# EAGLE design Schem (EAGLE 5.10)
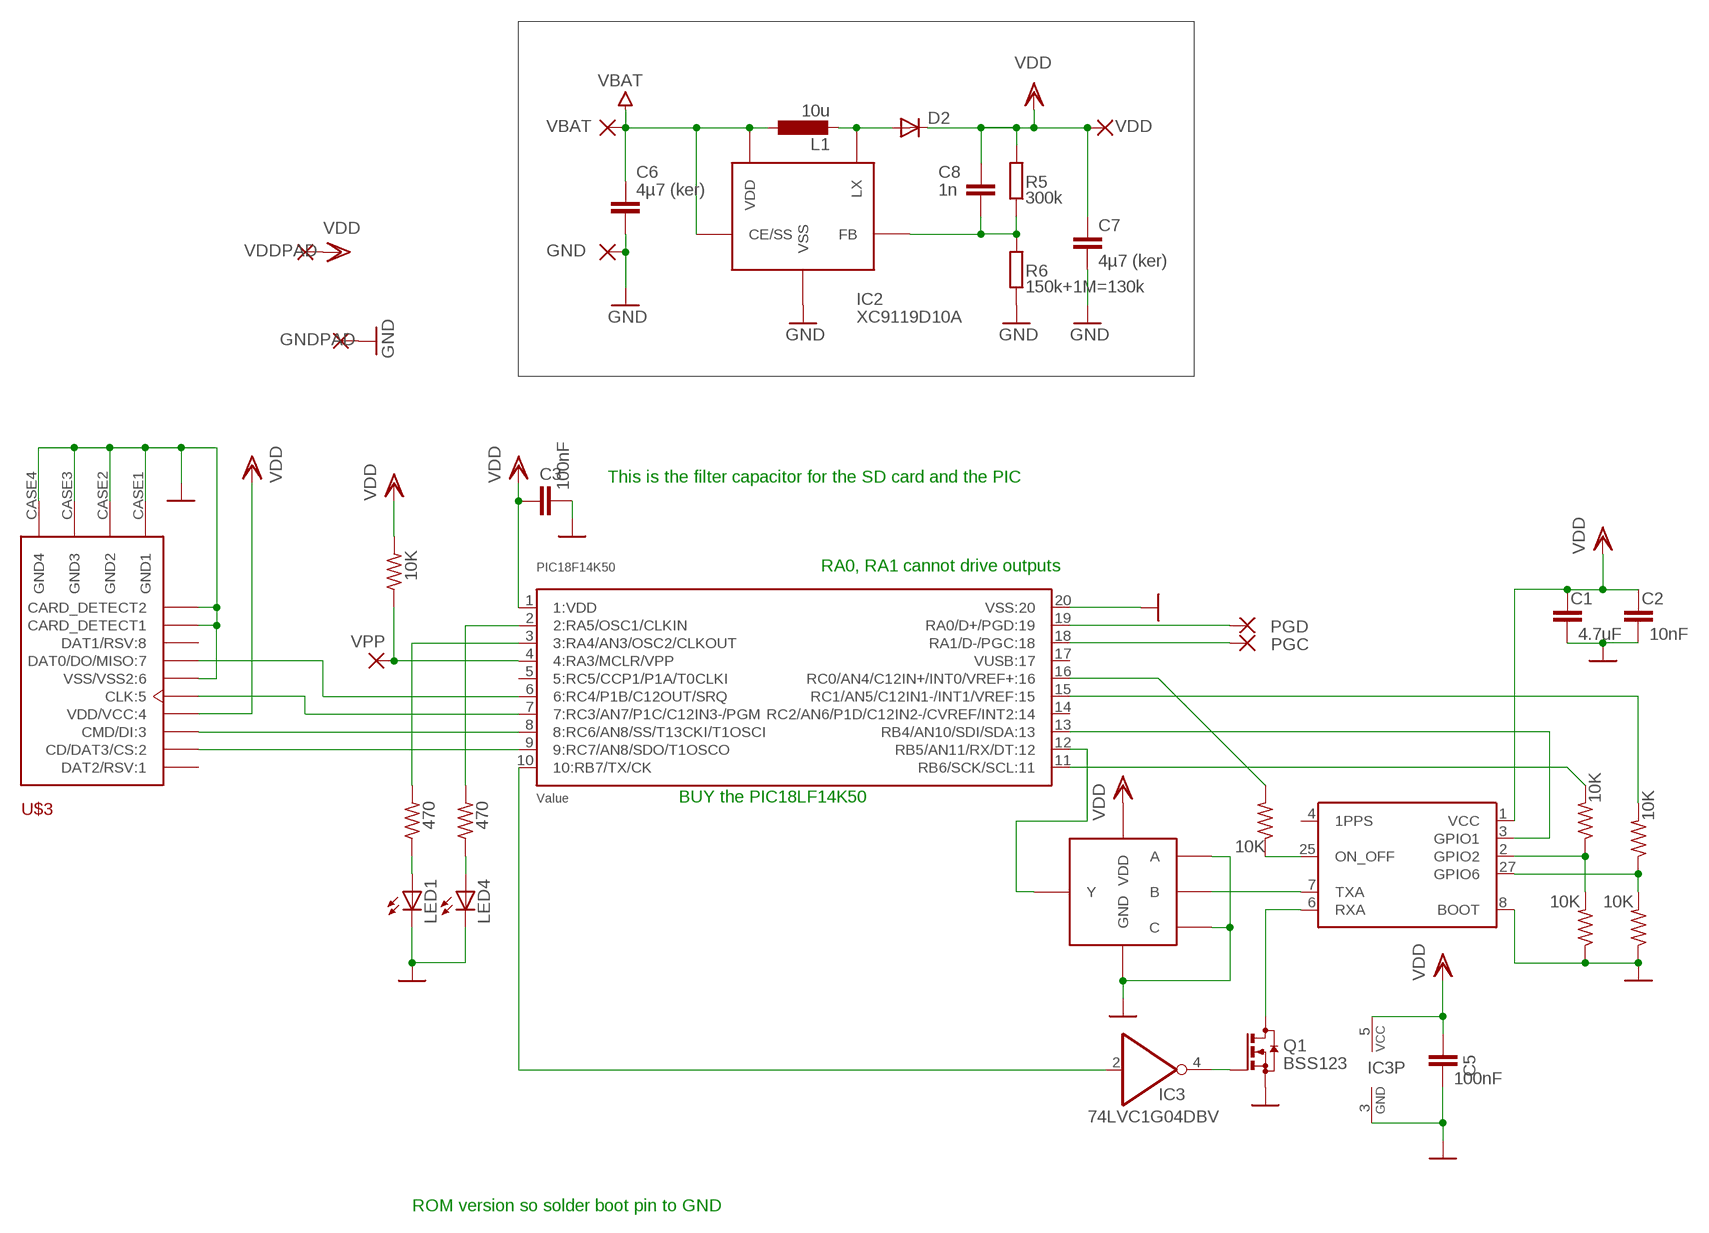
[diagram p0: schematic, sheet 1]

## Parts
C1  4.7uF  C-EUC0805  [C0805]
C2  10nF  C-EUC0805  [C0805]
C3  100nF  C-EUC0805  [C0805]
C5  100nF  C-EUC0805  [C0805]
C6  4µ7 (ker)  C-EUC0805  [C0805]
C7  4µ7 (ker)  C-EUC0805  [C0805]
C8  1n  C-EUC0805  [C0805]
D2  DIODE-MINIMELF  [MINIMELF]
GND  SMD2  [SMD1,27-2,54]
GNDPAD  SMD2  [SMD1,27-2,54]
IC2  XC9119D10A  [SOT23-5]
IC3  74LVC1G04DBV  [SOT23-5]
L1  10u  WE-TCP_DROSSELDEF  [WE-TPC]
LED1  LEDCHIPLED_0805  [CHIPLED_0805]
LED4  LEDCHIPLED_0805  [CHIPLED_0805]
PGC  SMD2  [SMD1,27-2,54]
PGD  SMD2  [SMD1,27-2,54]
Q1  BSS123  [SOT23]
R1  10K  R-US_M0805  [M0805]
R2  10K  R-US_M0805  [M0805]
R3  10K  R-US_M0805  [M0805]
R4  10K  R-US_M0805  [M0805]
R5  300k  R-EU_R0805  [R0805]
R6  150k+1M=130k  R-EU_R0805  [R0805]
R7  10K  R-US_M0805  [M0805]
R9  470  R-US_M0805  [M0805]
R10  10K  R-US_M0805  [M0805]
R11  470  R-US_M0805  [M0805]
U$1  FASTRAXUC322  [FASTRAXUC322]
U$2  PIC18LF14K50_DIP20  PIC18F14K50_DIP20  [SSOP20]
U$3  MIKRO_SD_CARD  [MIKRO_SD_CARD_HOLDER]
U$4  SN74AUP1T97  [SOT23-6]
VBAT  SMD2  [SMD1,27-2,54]
VDD  SMD2  [SMD1,27-2,54]
VDDPAD  SMD2  [SMD1,27-2,54]
VPP  SMD2  [SMD1,27-2,54]

## Nets
GND: C1.2 C2.2 C3.2 C5.2 C6.2 C7.2 GND.1(P) GNDPAD.1(P) IC2.P$2(VSS) IC3.3(GND) LED1.C LED4.C Q1.2(S) R2.1 R6.1 R7.1 U$1.8(BOOT) U$2.20(VSS:20) U$3.C_DETECT1(CARD_DETECT1) U$3.C_DETECT2(CARD_DETECT2) U$3.CASE1(GND1) U$3.CASE2(GND2) U$3.CASE3(GND3) U$3.CASE4(GND4) U$3.P6(VSS/VSS2:6) U$4.P$2(GND) U$4.P$3(A) U$4.P$6(C)
N$1: R1.1 U$2.4(4:RA3/MCLR/VPP) VPP.1(P)
N$2: IC3.2(I) U$2.10(10:RB7/TX/CK)
N$3: PGC.1(P) U$2.18(RA1/D-/PGC:18)
N$4: R4.1 R7.2 U$1.2(GPIO2)
N$5: U$2.12(RB5/AN11/RX/DT:12) U$4.P$4(Y)
N$6: R2.2 R3.1 U$1.27(GPIO6)
N$7: R10.2 U$2.16(RC0/AN4/C12IN+/INT0/VREF+:16)
N$9: D2.A IC2.P$1(LX) L1.P$2
N$10: C8.2 IC2.P$3(FB) R5.1 R6.2
N$11: IC3.4(O) Q1.1(G)
N$12: R4.2 U$2.11(RB6/SCK/SCL:11)
N$13: U$1.3(GPIO1) U$2.13(RB4/AN10/SDI/SDA:13)
N$14: Q1.3(D) U$1.6(RXA)
N$15: PGD.1(P) U$2.19(RA0/D+/PGD:19)
N$16: LED1.A R9.1
N$17: U$1.7(TXA) U$4.P$1(B)
N$18: R9.2 U$2.3(3:RA4/AN3/OSC2/CLKOUT)
N$19: R3.2 U$2.15(RC1/AN5/C12IN1-/INT1/VREF:15)
N$20: U$2.9(9:RC7/AN8/SDO/T1OSCO) U$3.P2(CD/DAT3/CS:2)
N$21: U$2.8(8:RC6/AN8/SS/T13CKI/T1OSCI) U$3.P3(CMD/DI:3)
N$22: U$2.7(7:RC3/AN7/P1C/C12IN3-/PGM) U$3.P5(CLK:5)
N$23: U$2.6(6:RC4/P1B/C12OUT/SRQ) U$3.P7(DAT0/DO/MISO:7)
N$25: R11.2 U$2.2(2:RA5/OSC1/CLKIN)
N$27: R10.1 U$1.25(ON_OFF)
N$30: LED4.A R11.1
VBAT: C6.1 IC2.P$4(CE/SS) IC2.P$5(VDD) L1.P$1 VBAT.1(P)
VDD: C1.1 C2.1 C3.1 C5.1 C7.1 C8.1 D2.C IC3.5(VCC) R1.2 R5.2 U$1.1(VCC) U$2.1(1:VDD) U$3.P4(VDD/VCC:4) U$4.P$5(VDD) VDD.1(P) VDDPAD.1(P)
Unconnected: U$1.4(1PPS) U$2.5(5:RC5/CCP1/P1A/T0CLKI) U$2.14(RC2/AN6/P1D/C12IN2-/CVREF/INT2:14) U$2.17(VUSB:17) U$3.P1(DAT2/RSV:1) U$3.P8(DAT1/RSV:8)

## Notes on the sheet
- This is the filter capacitor for the SD card and the PIC
- RA0, RA1 cannot drive outputs
- BUY the PIC18LF14K50
- ROM version so solder boot pin to GND

## Power pins joined to a net without a drawn wire
GND: U$1.5(GND) U$1.9(GND) U$1.10(GND) U$1.11(GND) U$1.12(GND) U$1.13(GND) U$1.14(GND) U$1.15(GND) U$1.16(GND) U$1.17(GND) U$1.18(GND) U$1.19(GND) U$1.20(GND) U$1.21(GND) U$1.22(GND) U$1.23(GND) U$1.24(GND) U$1.26(GND)

## Library data of the parts
C1-C3 C5-C8 = rcl:C-EU: CAPACITOR, European symbol
D2 = diode:DIODE-: DIODE
GND GNDPAD PGC PGD VBAT VDD VDDPAD VPP = wirepad:SMD2: SMD PAD
IC2 = 00 Meine Bauteile:XC9119D10A
IC3 = 74xx-little-de:74*1G04: INVERTER Gate
L1 = Parts_for_Marcus:WE-TCP_DROSSEL
LED1 LED4 = led:LED: LED OSRAM: - CHIPLED LG R971, LG N971, LY N971, LG Q971, LY Q971, LO R971, LY R971 LH N974, LH R974 LS Q976, LO Q976, LY Q976 LO Q996 - Hyper CHIPLED LW Q18S LB Q993, LB Q99A, LB R99A - SideLED LS A670, LO A670, LY A670, LG A670, LP A670 LB A673, LV A673, LT A673, LW A673 LH A674 LY A675 LS A676, LA A676, LO A676, LY A676, LW A676 LS A679, LY A679, LG A679 - Hyper Micro SIDELED® LS Y876, LA Y876, LO Y876, LY Y876 LT Y87S - SmartLED LW L88C, LW L88S LB L89C, LB L89S, LG L890 LS L89K, LO L89K, LY L89K LS L896, LA L896, LO L896, LY L896 - TOPLED LS T670, LO T670, LY T670, LG T670, LP T670 LSG T670, LSP T670, LSY T670, LOP T670, LYG T670 LG T671, LOG T671, LSG T671 LB T673, LV T673, LT T673, LW T673 LH T674 LS T676, LA T676, LO T676, LY T676, LB T676, LH T676, LSB T676, LW T676 LB T67C, LV T67C, LT T67C, LS T67K, LO T67K, LY T67K, LW E67C LS E67B, LA E67B, LO E67B, LY E67B, LB E67C, LV E67C, LT E67C LW T67C LS T679, LY T679, LG T679 LS T770, LO T770, LY T770, LG T770, LP T770 LB T773, LV T773, LT T773, LW T773 LH T774 LS E675, LA E675, LY E675, LS T675 LS T776, LA T776, LO T776, LY T776, LB T776 LHGB T686 LT T68C, LB T68C - Hyper Mini TOPLED® LB M676 - Mini TOPLED Santana® LG M470 LS M47K, LO M47K, LY M47K Source: http://www.osram.convergy.de LUXEON: - LUMILED® LXK2-PW12-R00, LXK2-PW12-S00, LXK2-PW14-U00, LXK2-PW14-V00 LXK2-PM12-R00, LXK2-PM12-S00, LXK2-PM14-U00 LXK2-PE12-Q00, LXK2-PE12-R00, LXK2-PE12-S00, LXK2-PE14-T00, LXK2-PE14-U00 LXK2-PB12-K00, LXK2-PB12-L00, LXK2-PB12-M00, LXK2-PB14-N00, LXK2-PB14-P00, LXK2-PB14-Q00 LXK2-PR12-L00, LXK2-PR12-M00, LXK2-PR14-Q00, LXK2-PR14-R00 LXK2-PD12-Q00, LXK2-PD12-R00, LXK2-PD12-S00 LXK2-PH12-R00, LXK2-PH12-S00 LXK2-PL12-P00, LXK2-PL12-Q00, LXK2-PL12-R00 Source: www.luxeon.com KINGBRIGHT: KA-3528ASYC Source: www.kingbright.com
Q1 = transistor-small-signal:BSS123: N-CHANNEL MOS FET
R1-R4 R7 R9-R11 = resistor:R-US_: RESISTOR, American symbol
R5 R6 = rcl:R-EU_: RESISTOR, European symbol
U$1 = MyLib:FASTRAXUC322: Fastrax UC322 OEM GPS Receiver module
U$2 = MyLib:PIC18F14K50_DIP20
U$3 = Parts_for_Marcus:MIKRO_SD_CARD
U$4 = buffer:SN74AUP1T97

## Board
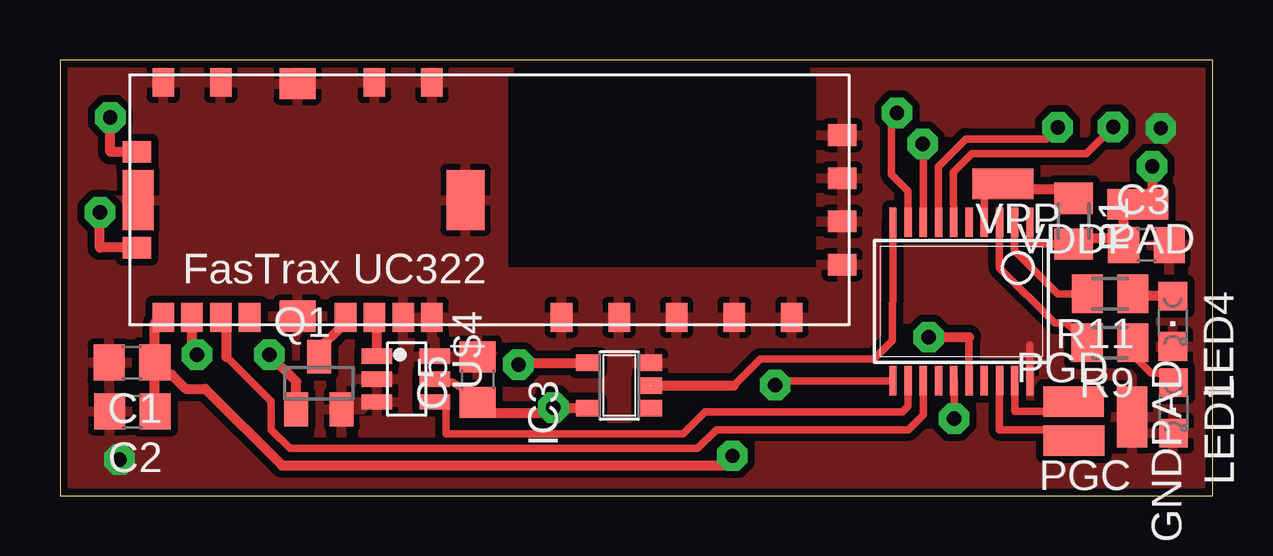
[diagram p1: board, top side]
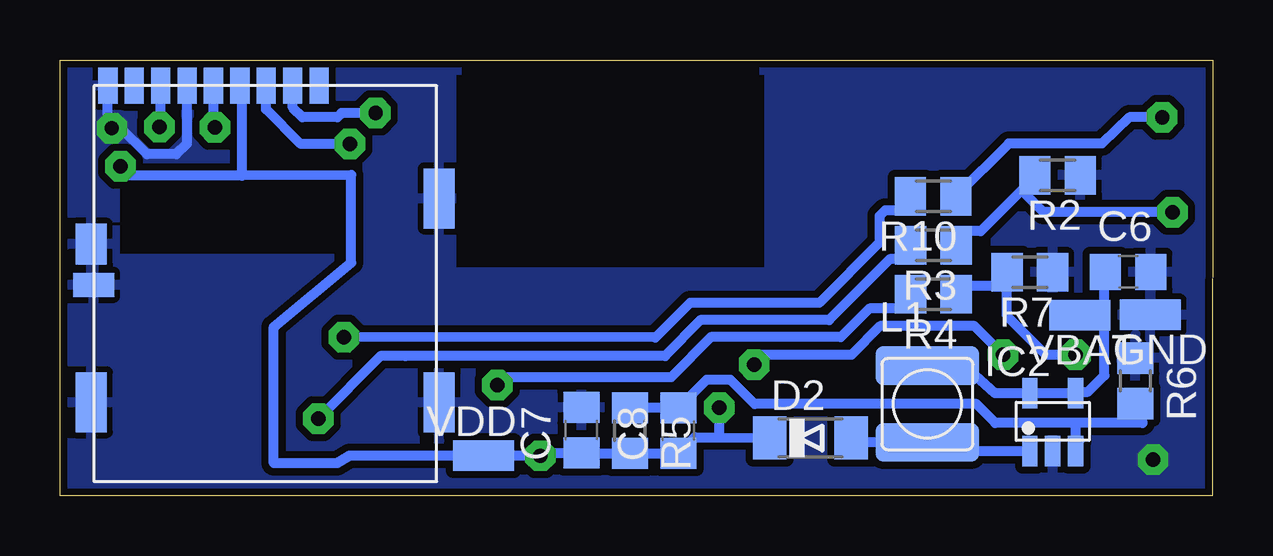
[diagram p2: board, bottom side, seen from below]

Size 48.04 x 18.18 mm. Coordinates in mm from the lower left corner, seen from the top.
Outline: 0,0 48.04,0 48.04,18.17 0,18.18 0,0
Copper layers (1*16): Top 0.035mm / dielectric 1.5mm / Bottom 0.035mm
Design rules "default *": minimum track width 10mil, minimum drill 0.6mm, track to track 12mil, track to pad 12mil, pad to pad 12mil, via to via 12mil, smd to smd 12mil, copper to edge 12mil, drill to drill 8mil, minimum pad ring 10mil, minimum via ring 8mil, stop-mask expansion 4mil, vias tented up to drill 0mil, thermal gap 10mil

### Footprints (pad centres in the part's own frame; a part is rotated, then mirrored left to right if it is on the bottom)
C0805 = smd 1.3 x 1.5: 1 -0.95,0; 2 0.95,0
MINIMELF = smd 1.4 x 1.8: A 1.7,0; C -1.7,0
SMD1,27-2,54 = smd 1.27 x 2.54: 1 0,0
SOT23-5 = smd 0.635 x 1.27: P$1 -0.953,-1.206; P$2 0,-1.206; P$3 0.953,-1.206; P$4 0.953,1.206; P$5 -0.953,1.206
SOT23-5' = smd 0.69 x 0.99: 1 -0.95,-1.29; 2 0,-1.29; 3 0.95,-1.29; 4 0.95,1.3; 5 -0.95,1.3
WE-TPC = smd 4.3 x 1.6: P$1 0,1.6; P$2 0,-1.6
CHIPLED_0805 = smd 1.2 x 1.2: A 0,-1.05; C 0,1.05
SOT23 = smd 1 x 1.4: 1 -0.95,-1.1; 2 0.95,-1.1; 3 0,1.1
M0805 = smd 1.3 x 1.6: 1 -0.95,0; 2 0.95,0
R0805 = smd 1.3 x 1.5: 1 -0.95,0; 2 0.95,0
FASTRAXUC322 = smd 0.9 x 1.2: 1 1.7,0.6; 2 2.9,0.6; 3 4.1,0.6; 4 5.3,0.6; 6 9.3,0.6; 7 10.5,0.6; 8 11.7,0.6; 9 12.9,0.6; 11 18.3,0.6; 12 20.7,0.6; 13 23.1,0.6; 14 25.5,0.6; 15 27.9,0.6; 20 12.9,10.4; 21 10.5,10.4; 23 4.1,10.4; 24 1.7,10.4 | smd 1.5 x 1.3: 5 7.3,0.65; 22 7.3,10.35 | smd 1.6 x 2.5: 10 14.3,5.5 | smd 1.2 x 0.9: 16 30,2.8; 17 30,4.6; 18 30,6.4; 19 30,8.2; 25 0.6,7.5; 27 0.6,3.5 | smd 1.3 x 2.5: 26 0.65,5.5
SSOP20 = smd 0.305 x 1.245: 1 -2.857,-3.302; 2 -2.222,-3.302; 3 -1.587,-3.302; 4 -0.952,-3.302; 5 -0.317,-3.302; 6 0.318,-3.302; 7 0.953,-3.302; 8 1.588,-3.302; 9 2.223,-3.302; 10 2.858,-3.302; 11 2.858,3.302; 12 2.223,3.302; 13 1.588,3.302; 14 0.953,3.302; 15 0.318,3.302; 16 -0.317,3.302; 17 -0.952,3.302; 18 -1.587,3.302; 19 -2.222,3.302; 20 -2.857,3.302
MIKRO_SD_CARD_HOLDER = smd 1.7 x 1: C_DETECT1 14.3,8.3 | smd 0.8 x 1.5: C_DETECT2 13.71,0; P1 4.91,0; P2 6.01,0; P3 7.11,0; P4 8.21,0; P5 9.31,0; P6 10.41,0; P7 11.51,0; P8 12.61,0 | smd 1.3 x 2.5: CASE1 -0.1,4.7; CASE2 -0.1,13.2; CASE3 14.4,13.2 | smd 1.3 x 1.7: CASE4 14.4,6.6
SOT23-6 = smd 0.635 x 1.27: P$1 -0.953,-1.206; P$2 0,-1.206; P$3 0.953,-1.206; P$4 0.953,1.206; P$5 0,1.206; P$6 -0.953,1.206

### Placement (x,y rotation side)
C1  3.01,5.57 180 top
C2  3.02,3.52 180 top
C3  45.28,10.47 0 top
C5  17.42,4.85 90 top
C6  3.53,9.35 0 bottom
C7  26.31,2.75 90 bottom
C8  22.27,2.72 90 bottom
D2  16.76,2.42 0 bottom
GND  2.6,7.55 90 bottom
GNDPAD  44.69,3.3 180 top
IC2  6.66,3.08 0 bottom
IC3  74LVC1G04DBV  [SOT23-5']  23.31,4.61 90 top
L1  11.89,3.83 0 bottom
LED1  46.41,3.67 180 top
LED4  46.38,7.28 180 top
PGC  42.26,2.3 90 top
PGD  42.25,3.93 270 top
Q1  10.8,4.71 0 top
R1  42.26,11.46 270 top
R2  6.46,13.37 180 bottom
R3  11.64,10.46 180 bottom
R4  11.64,8.42 180 bottom
R5  24.29,2.72 270 bottom
R6  3.22,4.8 270 bottom
R7  7.62,9.33 180 bottom
R9  43.77,6.4 180 top
R10  11.64,12.5 180 bottom
R11  43.77,8.43 180 top
U$1  2.61,6.85 0 top
U$2  37.57,8.11 180 top
U$3  32.34,17.1 180 bottom
U$4  14.42,4.88 270 top
VBAT  5.52,7.54 90 bottom
VDD  30.38,1.68 270 bottom
VDDPAD  44.92,12.16 90 top
VPP  39.31,13.01 90 top

### Tracks (layer width: path | path; a pad name or v marks a point on that pad's centre or on a via)
GND  (via drill 0.6 pad 1.27)
  Top 0.305: U$1.5 9.87,7.46 | U$4.P$6 15.69,5.84 | U$2.20 40.43,6.3 40.42,6.3
  Top 0.406: U$1.22 9.91,17.25 | U$1.23 6.71,17.2 | 6.77,17.25 6.77,17.37 6.64,17.37 | U$1.26 3.26,12.29 | 9.94,7.5 U$1.5 9.85,7.44 | U$1.15 30.51,7.55 | U$1.9 15.63,7.42
  Bottom 0.305: v45.89,15.34 46.05,15.4
  Bottom 0.406: IC2.P$2 6.69,1.88 | U$3.P6 42.75,14.7 43.19,14.25 44.41,14.25 45.5,15.34 v45.89,15.34 | 46.05,15.4 U$3.C_DETECT2
  other vias: 2.48,1.52
  pour Top: 0.52,18.16 18.71,18.16 18.71,16.97 31.48,16.97 31.48,18.16 47.82,18.16 47.82,0.51 0.47,0.51
  pour Bottom: 0.27,18.18 18.71,18.18 18.71,16.97 31.48,16.97 31.48,18.16 47.82,18.16 47.79,0.51 0.34,0.51 0.24,-0.05
N$1
  Top 0.305: 38.55,13.01 VPP.1 38.53,13.01 U$2.4
  Top 0.406: R1.1 41.67,12.65 41.67,12.81 40.31,12.81 VPP.1
N$2
  Top 0.305: U$2.10 34.71,11.21 34.71,9.68 34.69,6.48 33.92,5.71 29.2,5.71 28.09,4.6
  Top 0.406: IC3.2 28.09,4.6
N$3
  Top 0.305: U$2.18 39.16,2.77 41.49,2.77 41.49,2.45 PGC.1
N$4  (via drill 0.6 pad 1.27)
  Top 0.406: U$1.2 5.51,6.09 v5.7,5.89
  Bottom 0.406: R4.1 10.4,8.76 9.14,8.76 R7.2 | R7.2 8.57,9.32 | R7.2 8.57,7.51 6.95,5.89 v5.7,5.89
N$5
  Top 0.305: U$2.12 35.35,3.74 35.12,3.5 26.89,3.5 25.97,2.59 16.1,2.59 16.1,3.92 U$4.P$4
N$6  (via drill 0.6 pad 1.27)
  Top 0.406: U$1.27 3.19,10.36 1.66,10.36 v1.66,11.83
  Bottom 0.406: R3.1 10.1,11.05 9.66,11.05 7.76,12.95 | 7.76,12.95 7.41,13.3 R2.2 | v1.66,11.83 7.05,11.83 7.76,12.55 7.76,12.95
N$7  (via drill 0.6 pad 1.27)
  Top 0.305: 37.89,6.63 U$2.16
  Top 0.406: v36.21,6.63 37.89,6.63
  Bottom 0.406: v36.21,6.63 23.23,6.6 21.78,8.05 16.4,8.05 13.88,10.56 13.88,11.68 13.65,11.91 12.33,11.91 12.34,11.97 R10.2
N$9
  Bottom 0.406: IC2.P$1 11.5,1.87 L1.P$2 14.85,2.23 D2.A
N$10
  Bottom 0.406: 5.55,2.3 IC2.P$3 5.71,3.05 | 5.71,3.05 9.06,3.05 9.84,3.83 19.09,3.83 20.1,4.85 21.09,4.85 C8.2 R5.1 | 5.71,3.05 2.91,3.05 R6.2
N$11  (via drill 0.6 pad 1.27)
  Top 0.406: Q1.1 9.85,4.77 v8.73,5.89 | IC3.4 19.41,5.55 v19.11,5.48
  Bottom 0.406: v8.73,5.89 9.92,7.09 13.86,7.09 15.05,5.89 18.91,5.89 v19.11,5.48
N$12  (via drill 0.6 pad 1.27)
  Top 0.305: U$2.11 30,4.81 v29.81,4.62
  Bottom 0.406: R4.2 12.15,8.42 12.15,7.82 14.31,7.81 15.5,6.63 20.92,6.63 22.57,4.95 29.81,4.95 v29.81,4.62
N$13
  Top 0.305: 6.83,7.33 6.82,7.34 U$1.3 | U$2.13 35.98,4.6 35.98,3.38 35.37,2.77 27.37,2.77 26.58,1.98 9.59,1.98 8.8,2.77 8.8,3.93 6.95,5.79
  Top 0.406: U$1.3 6.64,7.45 | 6.82,7.34 6.95,7.21 6.95,5.79
N$14
  Top 0.305: U$1.6 11.81,7.36
  Top 0.406: Q1.3 10.83,6.17 11.67,7.01 11.93,7.43 U$1.6
N$15
  Top 0.305: U$2.19 39.8,3.53 41.82,3.53 41.82,3.93 PGD.1
N$16
  Top 0.305: LED1.A 45.78,5.13 45.48,5.13 44.72,5.89 R9.1
N$17
  Top 0.305: U$1.7
  Top 0.406: U$1.7 13.21,7.45 U$4.P$1
N$18
  Top 0.305: R9.2 41.95,7.21 41.47,7.21 39.16,9.52 U$2.3
N$19  (via drill 0.6 pad 1.27)
  Top 0.305: U$2.15 37.27,4.79 v37.27,3.22
  Bottom 0.406: R3.2 12.14,9.88 13.45,9.88 15.99,7.34 21.35,7.34 22.82,5.84 33.64,5.84 34.68,5.84 v37.27,3.22
N$20  (via drill 0.6 pad 1.27)
  Top 0.305: U$2.9 35.35,12.72 34.66,13.41 34.66,15.98 v34.89,15.98
  Bottom 0.305: 38.34,17.07 U$3.P2
  Bottom 0.406: 38.34,17.07 38.34,16.2 37.94,15.8 36.49,15.8 36.31,15.98 v34.89,15.98
N$21  (via drill 0.6 pad 1.27)
  Top 0.305: U$2.8 35.99,14.74 v35.95,14.68
  Bottom 0.305: 39.46,17.09 U$3.P3
  Bottom 0.406: v35.95,14.68 38.01,14.68 39.46,16.13 39.46,17.09
N$22  (via drill 0.6 pad 1.27)
  Top 0.305: U$2.7 36.62,13.75 37.76,14.88 41.11,14.88 v41.59,15.37
  Bottom 0.305: v41.59,15.37 41.65,15.37
  Bottom 0.406: 41.65,15.37 U$3.P5
N$23  (via drill 0.6 pad 1.27)
  Top 0.305: v43.9,15.39 42.79,14.27 38.01,14.27 37.25,13.51 37.25,12.79 U$2.6
  Bottom 0.305: v43.9,15.39 43.85,15.42
  Bottom 0.406: 43.85,15.42 U$3.P7
N$25
  Top 0.305: U$2.2 39.79,11.2 39.79,10.23 41.59,8.43 R11.2
N$27  (via drill 0.6 pad 1.27)
  Top 0.406: U$1.25 2.1,14.35 v2.1,15.8
  Bottom 0.406: v2.1,15.8 3.47,15.8 4.61,14.71 8.5,14.71 R10.1
N$30
  Top 0.406: R11.1 44.82,8.33 LED4.A
VBAT
  Bottom 0.406: IC2.P$5 IC2.P$4 5.63,4.34 5.19,4.34 4.51,5.03 4.51,7.79 | IC2.P$5 7.62,4.54 | 4.51,7.79 VBAT.1 | IC2.P$5 9.06,4.28 9.89,5.02 10.02,5.23 L1.P$1 | 4.51,7.79 4.51,9.01 C6.1
  Bottom 0.61: IC2.P$4 5.69,4.28
VDD  (via drill 0.6 pad 1.27)
  Top 0.305: C5.1 16.94,4.39 16.35,4.75 15.65,4.85 U$4.P$5 | R1.2 40.43,10.51 U$2.1
  Top 0.406: U$1.1 arc90 3.96,7.1 C1.1 | C1.1 arc-90 C1.1 | C2.1 3.96,3.53 3.96,5.05 | 3.96,5.05 C1.1 | IC3.5 22.01,3.68 v20.56,3.68 20.23,3.68 20,3.45 17.87,3.45 C5.1 | v28.03,1.67 27.62,1.27 9.26,1.27 6.06,4.47 5.25,4.47 4.66,5.05 3.96,5.05 | R1.2 42.36,10.71 42.66,10.74 44.04,10.74 C3.1 44.31,12.16 VDDPAD.1 45.53,12.16 v45.53,13.74
  Bottom 0.305: 40.45,17.01 U$3.P4 | VDD.1 29.94,1.67 29.93,1.67
  Bottom 0.406: 40.45,13.36 40.45,17.01 | 40.45,13.36 35.9,13.38 35.9,9.73 39.13,7.06 39.13,1.37 36.49,1.37 35.98,1.67 29.93,1.67 v28.03,1.67 27.91,1.8 C7.1 | C7.1 26.62,1.78 | 20.56,2.45 D2.C | 20.56,2.45 v20.56,3.68 | 20.56,2.45 21.59,2.45 C8.1 R5.2 26.74,1.77 C7.1 | 40.45,13.36 45.53,13.36 v45.53,13.74

### Text on the board
tStop: marcusbannerman.co.uk